# EAGLE design terraco_verde_pcb_impressa (EAGLE 9.5.2)
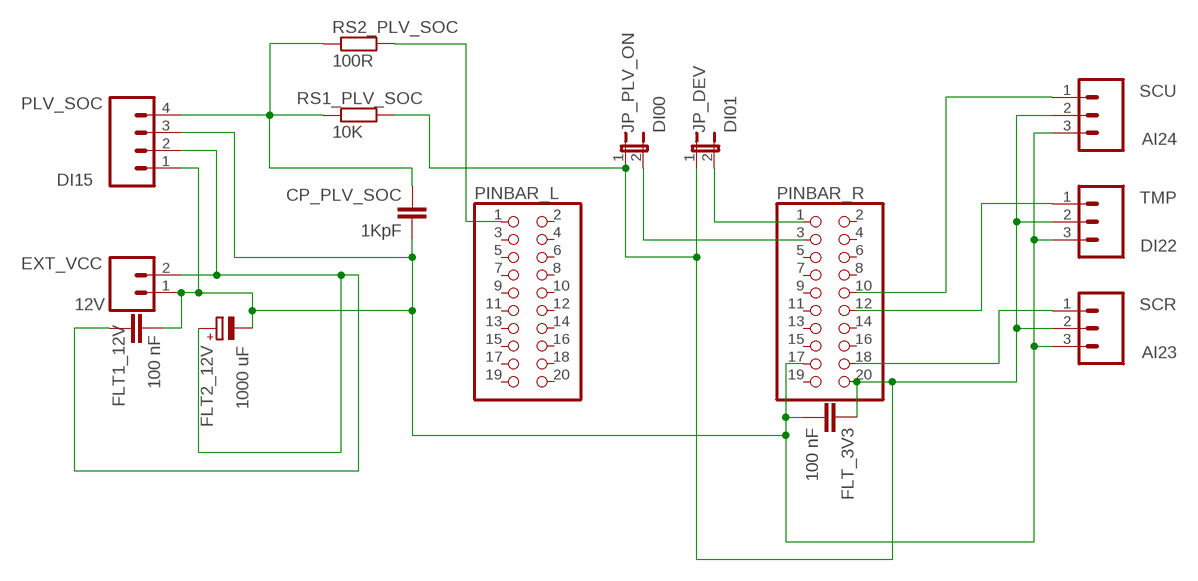
[diagram p0: schematic, sheet 1]

## Parts
CP_PLV_SOC  1KpF  C-EU025-024X044  [C025-024X044]
EXT_VCC  12V  M02  [02P]
FLT1_12V  100 nF  C-EU025-024X044  [C025-024X044]
FLT2_12V  1000 uF  CPOL-EUE5-5  [E5-5]
FLT_3V3  100 nF  C-EU025-024X044  [C025-024X044]
JP_DEV  DI01  JP1E  [JP1]
JP_PLV_ON  DI00  JP1E  [JP1]
PINBAR_L  0  PINHD-2X10  [2X10]
PINBAR_R  1  PINHD-2X10  [2X10]
PLV_SOC  DI15  M04  [04P]
RS1_PLV_SOC  10K  R-EU_0207/7  [0207/7]
RS2_PLV_SOC  100R  R-EU_0207/7  [0207/7]
SCR  AI23  M03  [03P]
SCU  AI24  M03  [03P]
TMP  DI22  M03  [03P]

## Nets
GND: CP_PLV_SOC.1 EXT_VCC.1 FLT1_12V.2 FLT2_12V.- FLT_3V3.2 PINBAR_R.17 PLV_SOC.1 PLV_SOC.3 SCR.3 SCU.3 TMP.3
NAI23: PINBAR_R.18 SCR.1
NAI24: PINBAR_R.10 SCU.1
NDI00: JP_PLV_ON.2 PINBAR_R.3
NDI01: JP_DEV.2 PINBAR_R.1
NDI15: PINBAR_L.1 RS2_PLV_SOC.2
NDI15_2: CP_PLV_SOC.2 PLV_SOC.4 RS1_PLV_SOC.1 RS2_PLV_SOC.1
NDI22: PINBAR_R.12 TMP.1
VCC_3V3: FLT_3V3.1 JP_DEV.1 JP_PLV_ON.1 PINBAR_R.20 RS1_PLV_SOC.2 SCR.2 SCU.2 TMP.2
VCC_12V: EXT_VCC.2 FLT1_12V.1 FLT2_12V.+ PLV_SOC.2
Unconnected: PINBAR_L.2 PINBAR_L.3 PINBAR_L.4 PINBAR_L.5 PINBAR_L.6 PINBAR_L.7 PINBAR_L.8 PINBAR_L.9 PINBAR_L.10 PINBAR_L.11 PINBAR_L.12 PINBAR_L.13 PINBAR_L.14 PINBAR_L.15 PINBAR_L.16 PINBAR_L.17 PINBAR_L.18 PINBAR_L.19 PINBAR_L.20 PINBAR_R.2 PINBAR_R.4 PINBAR_R.5 PINBAR_R.6 PINBAR_R.7 PINBAR_R.8 PINBAR_R.9 PINBAR_R.11 PINBAR_R.13 PINBAR_R.14 PINBAR_R.15 PINBAR_R.16 PINBAR_R.19

## Library data of the parts
CP_PLV_SOC FLT1_12V FLT_3V3 = rcl:C-EU: CAPACITOR, European symbol; SPICEPREFIX: C
EXT_VCC = con-amp-quick:M02: AMP QUICK CONNECTOR; OC_FARNELL: unknown; OC_NEWARK: unknown
FLT2_12V = rcl:CPOL-EU: POLARIZED CAPACITOR, European symbol; SPICEPREFIX: C
JP_DEV JP_PLV_ON = jumper:JP1E: JUMPER
PINBAR_L PINBAR_R = pinhead:PINHD-2X10: PIN HEADER
PLV_SOC = con-amp-quick:M04: AMP QUICK CONNECTOR; OC_FARNELL: unknown; OC_NEWARK: unknown
RS1_PLV_SOC RS2_PLV_SOC = rcl:R-EU_: RESISTOR, European symbol; SPICEPREFIX: R
SCR SCU TMP = con-amp-quick:M03: AMP QUICK CONNECTOR; OC_FARNELL: unknown; OC_NEWARK: unknown

## Board
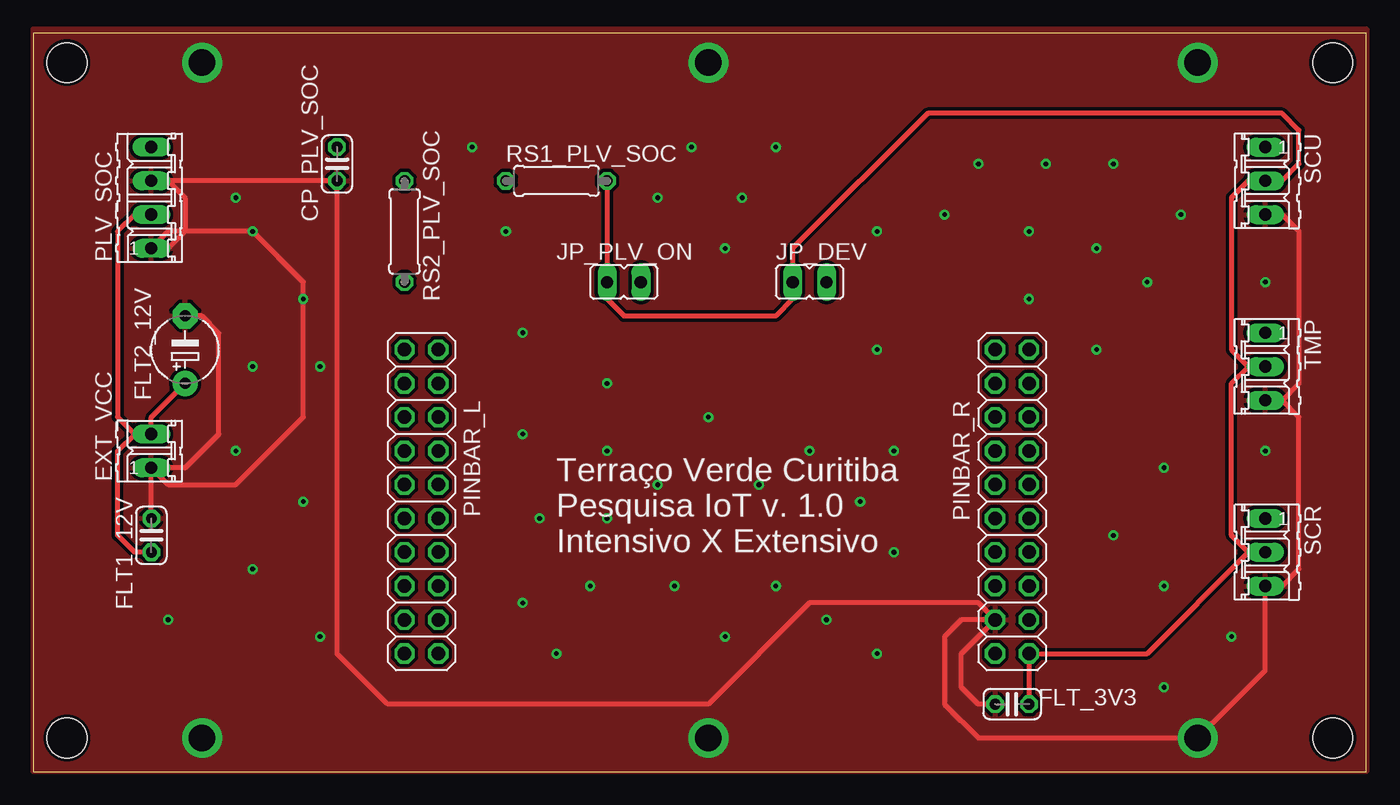
[diagram p1: board, top side]
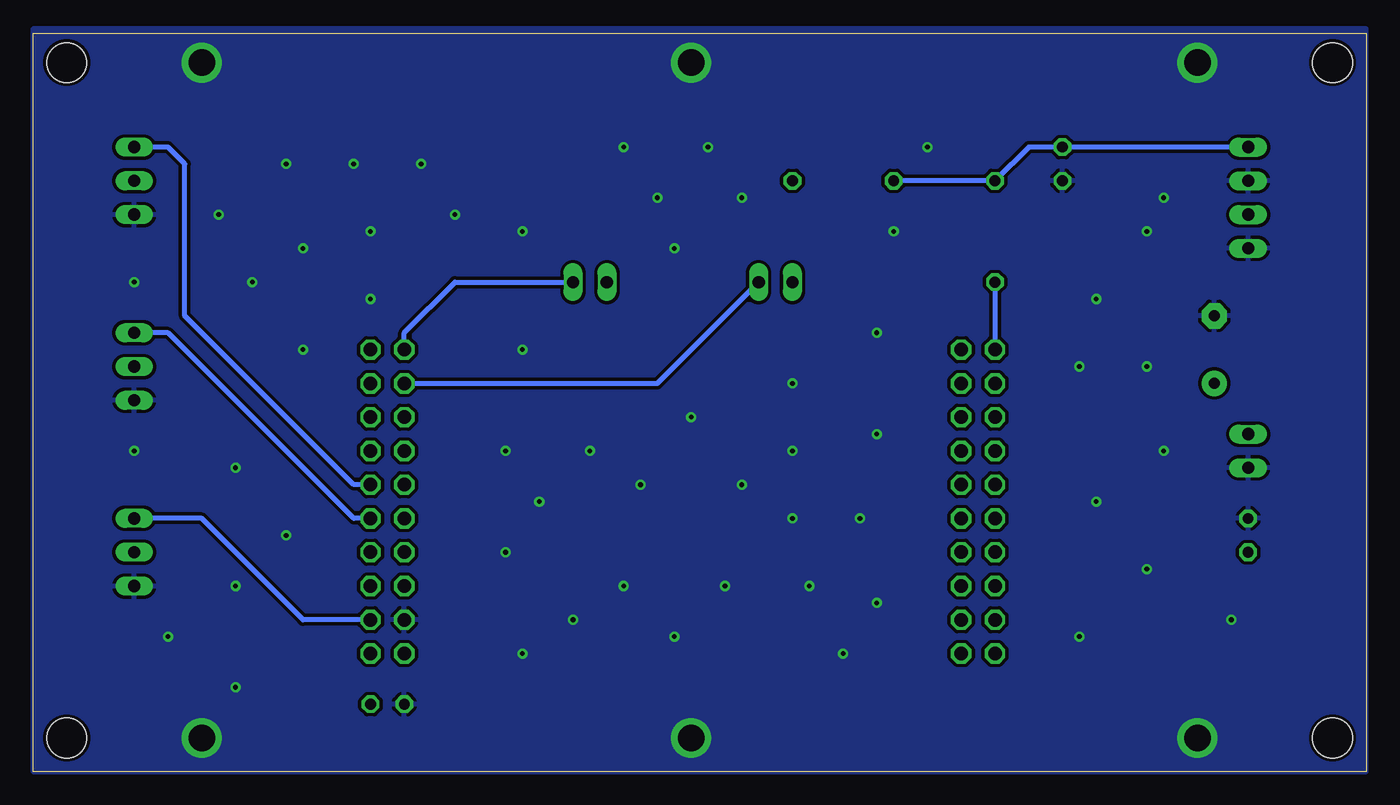
[diagram p2: board, bottom side, seen from below]

Size 100.31 x 55.55 mm. Coordinates in mm from the lower left corner, seen from the top.
Outline: 0,0 100.31,0 100.31,55.55 0,55.55 0,0
Copper layers (1*16): Top 0.035mm / dielectric 1.5mm / Bottom 0.035mm
Design rules "default *": minimum track width 6mil, minimum drill 0.35mm, track to track 6mil, track to pad 6mil, pad to pad 6mil, via to via 6mil, smd to smd 6mil, copper to edge 0mil, drill to drill 6mil, minimum pad ring 10mil, minimum via ring 8mil, stop-mask expansion 4mil, vias tented up to drill 0mil, thermal gap 10mil
Holes 3 mm at 2.54,53.34 2.54,2.54 97.79,2.54 97.79,53.34

### Footprints (pad centres in the part's own frame; a part is rotated, then mirrored left to right if it is on the bottom)
C025-024X044 = drill 0.813 octagon: 1 -1.27,0; 2 1.27,0
02P = drill 0.914 long: 1 -1.27,0; 2 1.27,0
E5-5 = drill 0.813 pad 1.905: + -2.54,0 | drill 0.813 pad 1.905 octagon: - 2.54,0
JP1 = drill 0.914 long: 1 0,-1.27; 2 0,1.27
2X10 = drill 1.016 octagon: 1 -11.43,-1.27; 2 -11.43,1.27; 3 -8.89,-1.27; 4 -8.89,1.27; 5 -6.35,-1.27; 6 -6.35,1.27; 7 -3.81,-1.27; 8 -3.81,1.27; 9 -1.27,-1.27; 10 -1.27,1.27; 11 1.27,-1.27; 12 1.27,1.27; 13 3.81,-1.27; 14 3.81,1.27; 15 6.35,-1.27; 16 6.35,1.27; 17 8.89,-1.27; 18 8.89,1.27; 19 11.43,-1.27; 20 11.43,1.27
04P = drill 0.914 long: 1 -3.81,0; 2 -1.27,0; 3 1.27,0; 4 3.81,0
0207/7 = drill 0.813 octagon: 1 -3.81,0; 2 3.81,0
03P = drill 0.914 long: 1 -2.54,0; 2 0,0; 3 2.54,0

### Placement (x,y rotation side)
CP_PLV_SOC  22.86,45.72 90 top
EXT_VCC  8.89,24.13 90 top
FLT1_12V  8.89,17.78 90 top
FLT2_12V  11.43,31.75 90 top
FLT_3V3  73.66,5.08 180 top
JP_DEV  58.42,36.83 270 top
JP_PLV_ON  44.45,36.83 270 top
PINBAR_L  29.21,20.32 270 top
PINBAR_R  73.66,20.32 270 top
PLV_SOC  8.89,43.18 90 top
RS1_PLV_SOC  39.37,44.45 0 top
RS2_PLV_SOC  27.94,40.64 270 top
SCR  92.71,16.51 270 top
SCU  92.71,44.45 270 top
TMP  92.71,30.48 270 top

### Tracks (layer width: path | path; a pad name or v marks a point on that pad's centre or on a via)
GND  (via drill 0.35, 2)
  Top 0.381: 93.98,27.94 TMP.3 | SCU.3 93.98,41.91 95.25,40.64 95.25,29.21 93.98,27.94 | 93.98,27.94 95.25,26.67 95.25,15.24 93.98,13.97 SCR.3 92.71,7.62 v87.63,2.54 71.12,2.54 68.58,5.08 68.58,10.16 69.85,11.43 PINBAR_R.17 | FLT_3V3.2 71.12,5.08 69.85,6.35 69.85,8.89 PINBAR_R.17 | PINBAR_R.17 71.12,12.7 58.42,12.7 50.8,5.08 26.67,5.08 22.86,8.89 CP_PLV_SOC.1 PLV_SOC.3 10.16,44.45 11.43,43.18 11.43,40.64 10.16,39.37 PLV_SOC.1 10.16,40.64 v16.51,40.64 20.32,36.83 v20.32,35.56 20.32,26.67 15.24,21.59 10.16,21.59 EXT_VCC.1 | FLT1_12V.2 EXT_VCC.1 | FLT2_12V.- 12.7,34.29 13.97,33.02 13.97,25.4 11.43,22.86 EXT_VCC.1
  other vias: 12.7,53.34 50.8,53.34 50.8,2.54 12.7,2.54 87.63,53.34 85.09,13.97 36.83,25.4 36.83,12.7 52.07,39.37 15.24,24.13 59.69,11.43 63.5,31.75 71.12,45.72 43.18,29.21 54.61,21.59 50.8,26.67 16.51,30.48 74.93,35.56 55.88,13.97 20.32,20.32 16.51,15.24 41.91,13.97 52.07,10.16 62.23,20.32 21.59,30.48 83.82,36.83 63.5,8.89 64.77,16.51 64.77,24.13 48.26,13.97 68.58,41.91 43.18,19.05 58.42,24.13 74.93,40.64 43.18,24.13 80.01,39.37 80.01,31.75 38.1,19.05 63.5,40.64 39.37,8.89 46.99,21.59 85.09,22.86 21.59,10.16 10.16,11.43 81.28,45.72 36.83,33.02 53.34,43.18 35.56,40.64 90.17,10.16 81.28,17.78 55.88,46.99 33.02,46.99 49.53,46.99 86.36,41.91 76.2,45.72 46.99,43.18 15.24,43.18 92.71,36.83 92.71,24.13 85.09,6.35
  pour Top (isolate 0.254): 0,55.88 100.33,55.88 100.33,0 0,0
  pour Bottom (isolate 0.254): 0,55.88 100.33,55.88 100.33,0 0,0
NAI23
  Bottom 0.381: SCR.1 87.63,19.05 80.01,11.43 PINBAR_R.18
NAI24
  Bottom 0.381: PINBAR_R.10 76.2,21.59 88.9,34.29 88.9,45.72 90.17,46.99 SCU.1
NDI00
  Bottom 0.381: JP_PLV_ON.2 53.34,29.21 PINBAR_R.3
NDI01
  Bottom 0.381: PINBAR_R.1 72.39,33.02 68.58,36.83 JP_DEV.2
NDI15
  Bottom 0.381: RS2_PLV_SOC.2 PINBAR_L.1
NDI15_2
  Bottom 0.381: RS1_PLV_SOC.1 RS2_PLV_SOC.1 25.4,46.99 CP_PLV_SOC.2 PLV_SOC.4
NDI22
  Bottom 0.381: PINBAR_R.12 76.2,19.05 90.17,33.02 TMP.1
VCC_3V3
  Top 0.381: FLT_3V3.1 PINBAR_R.20 83.82,8.89 91.44,16.51 | RS1_PLV_SOC.2 JP_PLV_ON.1 43.18,35.56 44.45,34.29 55.88,34.29 57.15,35.56 JP_DEV.1 57.15,39.37 67.31,49.53 93.98,49.53 95.25,48.26 95.25,45.72 93.98,44.45 SCU.2 91.44,44.45 90.17,43.18 90.17,31.75 91.44,30.48 | 91.44,30.48 TMP.2 | SCR.2 91.44,16.51 | 91.44,16.51 90.17,17.78 90.17,29.21 91.44,30.48
VCC_12V
  Top 0.381: FLT1_12V.1 7.62,16.51 6.35,17.78 6.35,24.13 7.62,25.4 | 7.62,25.4 EXT_VCC.2 8.89,26.67 FLT2_12V.+ | PLV_SOC.2 7.62,41.91 6.35,40.64 6.35,26.67 7.62,25.4

### Text on the board
tNames: Terraço Verde Curitiba / Pesquisa IoT v. 1.0 / Intensivo X Extensivo